# EAGLE design snullv5 (EAGLE 7.2.0)
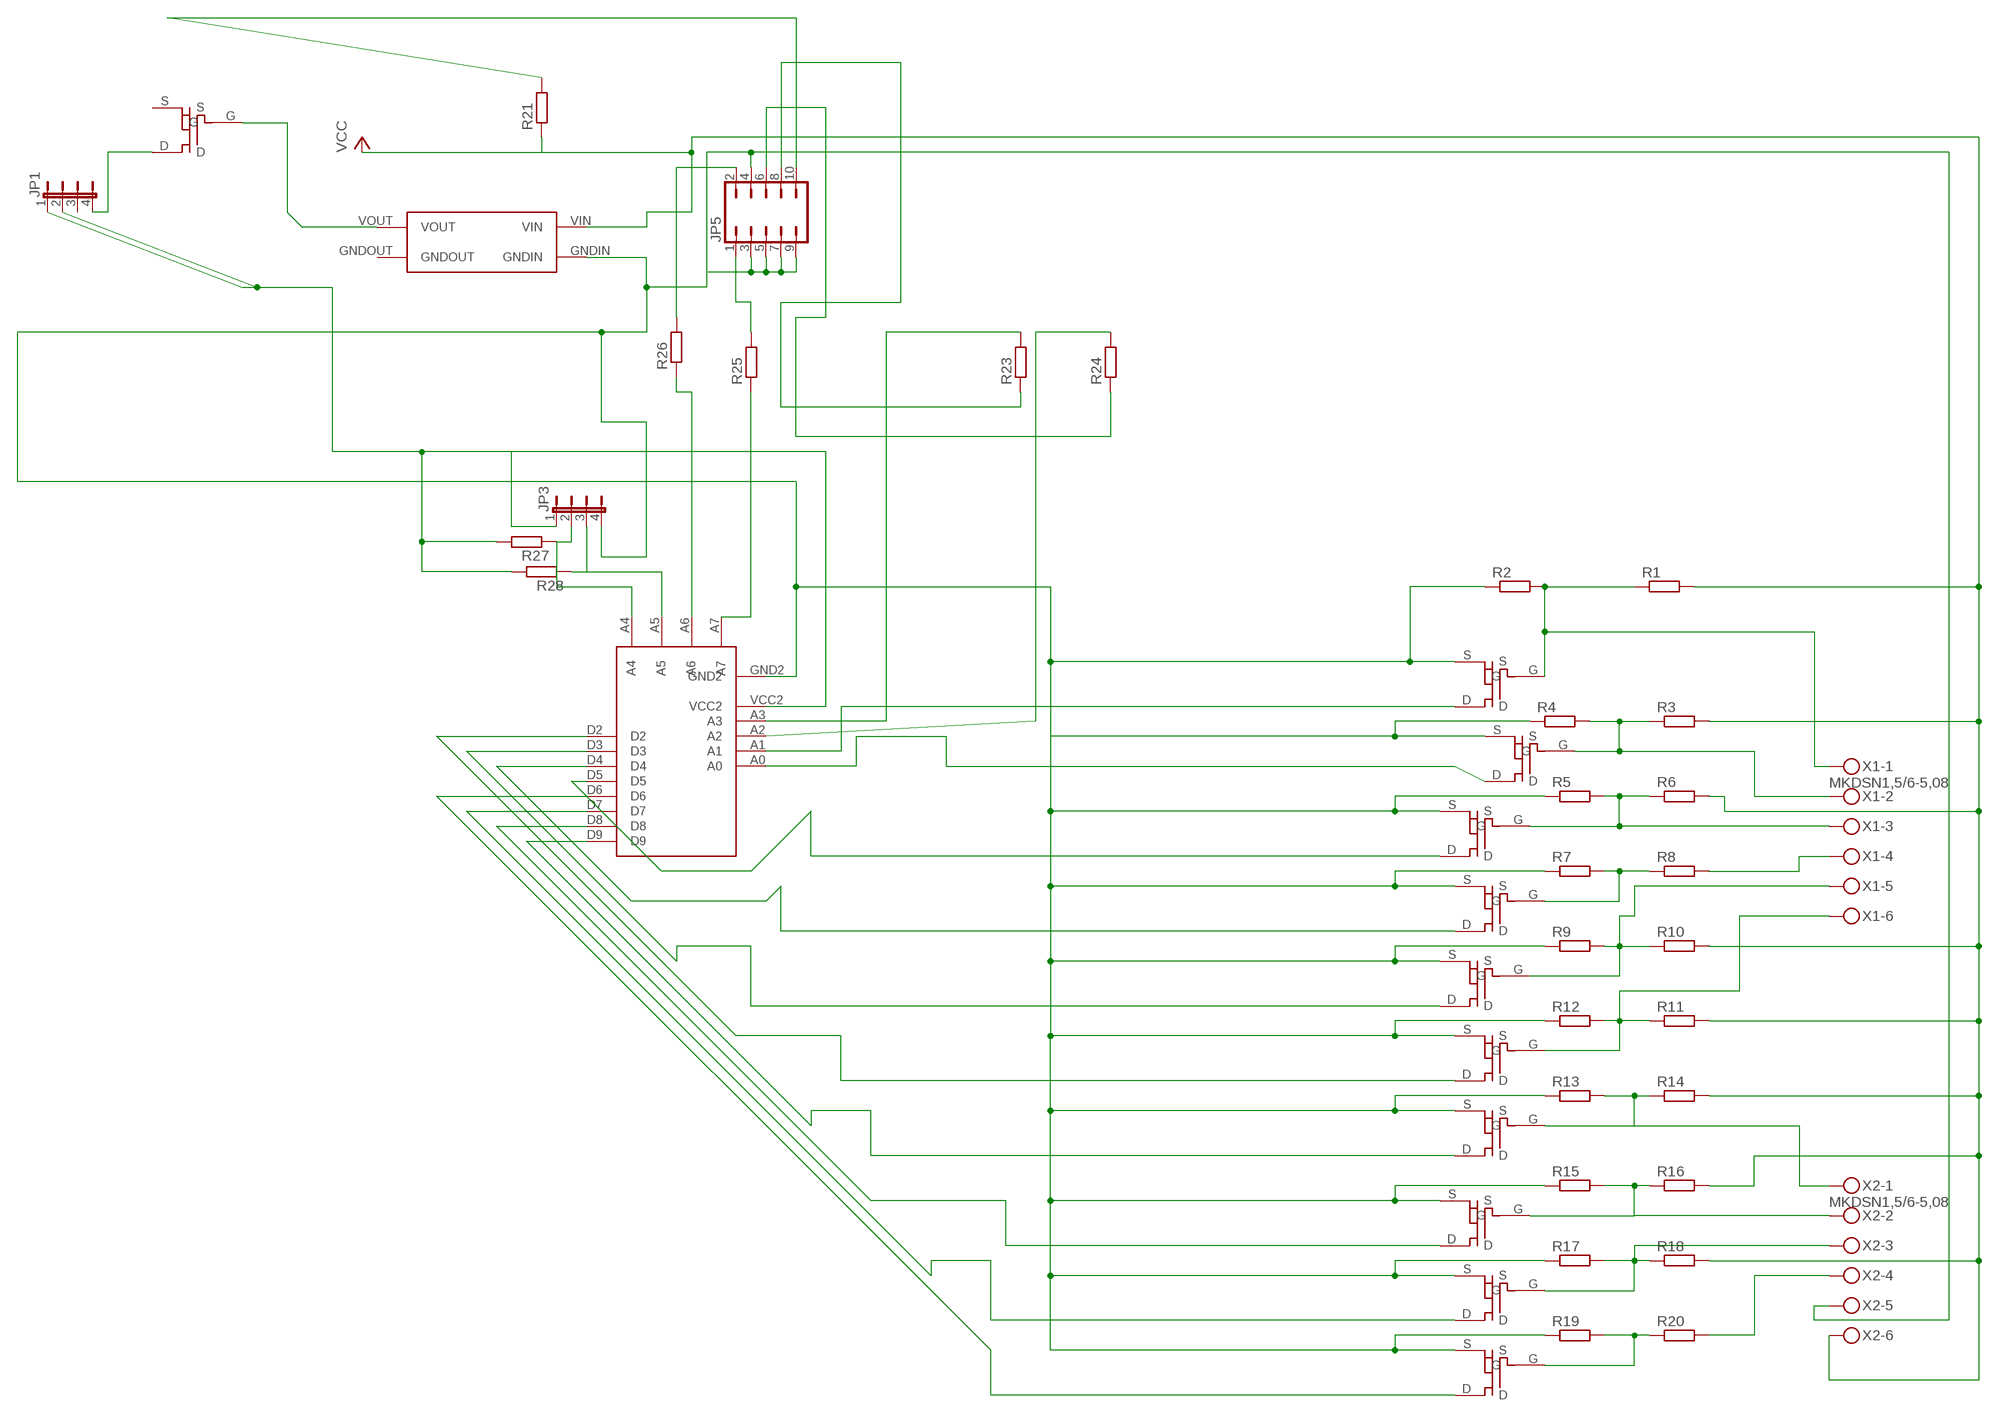
[diagram p0: schematic, sheet 1]

## Parts
JP1  JP4E  [JP4]
JP3  JP4E  [JP4]
JP5  JP5Q  [JP5Q]
R1  R-EU_R0805  [R0805]
R2  R-EU_R0805  [R0805]
R3  R-EU_R0805  [R0805]
R4  R-EU_R0805  [R0805]
R5  R-EU_R0805  [R0805]
R6  R-EU_R0805  [R0805]
R7  R-EU_R0805  [R0805]
R8  R-EU_R0805  [R0805]
R9  R-EU_R0805  [R0805]
R10  R-EU_R0805  [R0805]
R11  R-EU_R0805  [R0805]
R12  R-EU_R0805  [R0805]
R13  R-EU_R0805  [R0805]
R14  R-EU_R0805  [R0805]
R15  R-EU_R0805  [R0805]
R16  R-EU_R0805  [R0805]
R17  R-EU_R0805  [R0805]
R18  R-EU_R0805  [R0805]
R19  R-EU_R0805  [R0805]
R20  R-EU_R0805  [R0805]
R21  R-EU_R0805  [R0805]
R23  R-EU_R0805  [R0805]
R24  R-EU_R0805  [R0805]
R25  R-EU_R0805  [R0805]
R26  R-EU_R0805  [R0805]
R27  R-EU_R0805  [R0805]
R28  R-EU_R0805  [R0805]
U$1  ARDUINOPROMINIREDUCED  [ARDUINOPROMINIREDUCED]
U$2  VREGMODULE  [VREGMODULE]
U$3  MOSFET-TO236  [MOSFET-TO236]
U$4  MOSFET-TO236  [MOSFET-TO236]
U$5  MOSFET-TO236  [MOSFET-TO236]
U$6  MOSFET-TO236  [MOSFET-TO236]
U$7  MOSFET-TO236  [MOSFET-TO236]
U$8  MOSFET-TO236  [MOSFET-TO236]
U$9  MOSFET-TO236  [MOSFET-TO236]
U$10  MOSFET-TO236  [MOSFET-TO236]
U$11  MOSFET-TO236  [MOSFET-TO236]
U$12  MOSFET-TO236  [MOSFET-TO236]
U$13  MOSFET-TO236  [MOSFET-TO236]
X1  MKDSN1,5/6-5,08  [MKDSN1,5/6-5,08]
X2  MKDSN1,5/6-5,08  [MKDSN1,5/6-5,08]

## Nets
N$1: R13.2 R14.1 U$9.G X2.1
N$2: R9.2 R10.1 U$7.G X1.5
N$4: R15.2 R16.1 U$10.G X2.2
N$5: R17.2 R18.1 U$11.G X2.3
N$7: R8.2 X1.4
N$8: U$1.A0 U$4.D
N$10: U$1.A1 U$3.D
N$12: JP1.1 JP1.2 JP3.1 R27.2 R28.2 U$1.VCC2
N$13: U$1.D9 U$9.D
N$14: U$1.D4 U$6.D
N$15: U$1.D3 U$7.D
N$16: U$1.D8 U$10.D
N$17: U$1.D2 U$8.D
N$18: U$1.D5 U$5.D
N$19: U$2.VOUT U$13.G
N$21: U$1.D6 U$12.D
N$22: R1.1 R2.2 U$3.G X1.1
N$23: R3.1 R4.2 U$4.G X1.2
N$24: U$1.D7 U$11.D
N$25: R5.2 R6.1 U$5.G X1.3
N$27: R7.2 R8.1 U$6.G
N$28: R11.1 R12.2 U$8.G X1.6
N$30: R20.2 X2.4
N$31: R19.2 R20.1 U$12.G
N$34: JP5.10 R21.2
N$35: JP1.4 U$13.D
N$36: JP5.8 R23.1
N$37: JP5.6 R24.1
N$38: R23.2 U$1.A3
N$39: R24.2 U$1.A2
N$40: JP3.2 R27.1 U$1.A4
N$41: JP3.3 R28.1 U$1.A5
N$42: R26.1 U$1.A6
N$43: JP5.2 R26.2
N$44: R25.1 U$1.A7
N$45: JP5.1 R25.2
VCC: R1.2 R3.2 R6.2 R10.2 R11.2 R14.2 R16.2 R18.2 R21.1 U$2.VIN X2.6
VDD: JP3.4 JP5.3 JP5.4 JP5.5 JP5.7 JP5.9 R2.1 R4.1 R5.1 R7.1 R9.1 R12.1 R13.1 R15.1 R17.1 R19.1 U$1.GND2 U$2.GNDIN U$3.S U$4.S U$5.S U$6.S U$7.S U$8.S U$9.S U$10.S U$11.S U$12.S X2.5
Unconnected: JP1.3 U$2.GNDOUT U$13.S

## Library data of the parts
JP1 JP3 = jumper:JP4E: JUMPER
JP5 = jumper:JP5Q: JUMPER
R1-R21 R23-R28 = resistor:R-EU_: RESISTOR, European symbol
U$1 = snulllib:ARDUINOPROMINIREDUCED
U$2 = snulllib:VREGMODULE
U$3-U$13 = snulllib:MOSFET-TO236
X1 X2 = con-phoenix-508:MKDSN1,5/6-5,08: MKDSN 1,5/ 6-5,08 Printklemme Nennstrom: 13,5 A Nennspannung: 250 V Rastermaß: 5,08 mm Polzahl: 6 Anschlussart: Schraubanschluss Montage: Löten Anschlussrichtung Leiter/Platine: 0 ° Artikelnummer: 1729160 Source: http://eshop.phoenixcontact.com .. 1729160.pdf

## Board
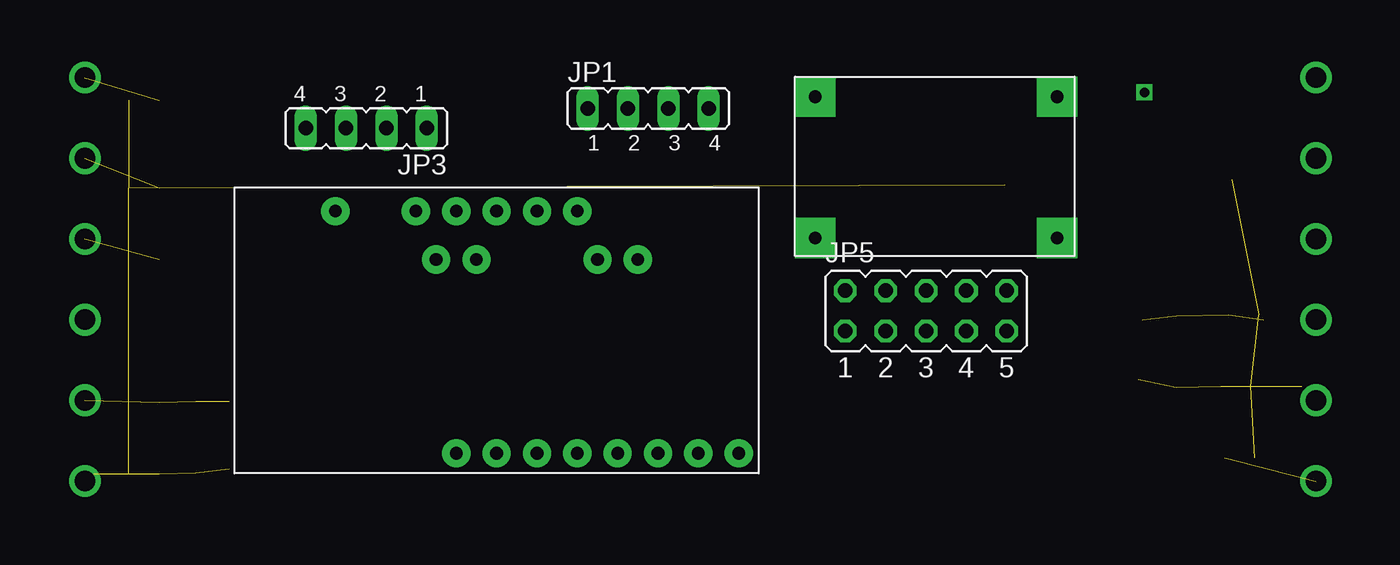
[diagram p1: board, top side]
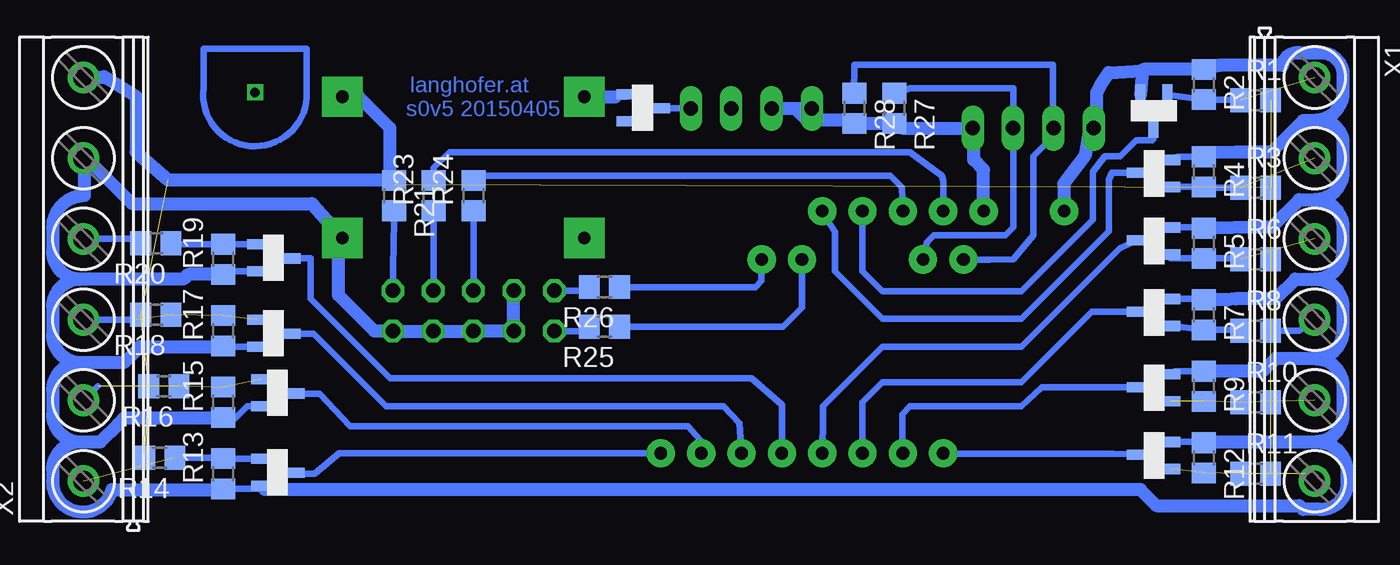
[diagram p2: board, bottom side, seen from below]

No outline drawn. Coordinates in mm, seen from the top.
Copper layers (1*16): Top 0.035mm / dielectric 1.5mm / Bottom 0.035mm
Design rules "default": minimum track width 10mil, minimum drill 24mil, track to track 8mil, track to pad 8mil, pad to pad 8mil, via to via 8mil, smd to smd 8mil, copper to edge 40mil, drill to drill 8mil, minimum pad ring 10mil, minimum via ring 8mil, stop-mask expansion 4mil, vias tented up to drill 0mil, thermal gap 10mil

### Footprints (pad centres in the part's own frame; a part is rotated, then mirrored left to right if it is on the bottom)
JP4 = drill 0.914 long: 1 -3.81,0; 2 -1.27,0; 3 1.27,0; 4 3.81,0
JP5Q = drill 0.914 octagon: 1 -5.08,-1.27; 2 -5.08,1.27; 3 -2.54,-1.27; 4 -2.54,1.27; 5 0,-1.27; 6 0,1.27; 7 2.54,-1.27; 8 2.54,1.27; 9 5.08,-1.27; 10 5.08,1.27
R0805 = smd 1.3 x 1.5: 1 -0.95,0; 2 0.95,0
ARDUINOPROMINIREDUCED = drill 0.8 pad 1.778: A0 16.51,-21.59; A1 16.51,-19.05; A2 16.51,-16.51; A3 16.51,-13.97; A4 13.462,-15.24; A5 13.462,-12.7; A6 13.462,-25.4; A7 13.462,-22.86; D2 1.27,-13.97; D3 1.27,-16.51; D4 1.27,-19.05; D5 1.27,-21.59; D6 1.27,-24.13; D7 1.27,-26.67; D8 1.27,-29.21; D9 1.27,-31.75; GND2 16.51,-6.35; VCC2 16.51,-11.43
VREGMODULE = drill 0.8 pad 2.54 square: GNDIN 16.51,-10.16; GNDOUT 1.27,-10.16; VIN 16.51,-1.27; VOUT 1.27,-1.27
MOSFET-TO236 = smd 0.635 x 1.27: D 1.5,1.73; G 0.6,-0.37; S 2.3,-0.37
MKDSN1,5/6-5,08 = drill 1.3 pad 2: 1 -12.7,0.025; 2 -7.62,0.025; 3 -2.54,0.025; 4 2.54,0.025; 5 7.62,0.025; 6 12.7,0.025

### Placement (x,y rotation side)
JP1  39.25,26 0 top
JP3  21.5,24.75 180 top
JP5  56.75,13.25 0 top
R1  7.5,26.5 0 bottom
R2  10.75,27.5 270 bottom
R3  7.5,21 0 bottom
R4  10.75,22 270 bottom
R5  10.75,17.5 270 bottom
R6  7.5,16.5 0 bottom
R7  10.75,13 270 bottom
R8  7.5,12 0 bottom
R9  10.75,8.5 270 bottom
R10  7.5,7.5 0 bottom
R11  7.5,3 0 bottom
R12  10.75,4 270 bottom
R13  72.5,3 90 bottom
R14  76.5,4 180 bottom
R15  72.5,7.5 90 bottom
R16  76.25,8.5 180 bottom
R17  72.5,12 90 bottom
R18  76.75,13 180 bottom
R19  72.5,16.5 90 bottom
R20  76.75,17.5 180 bottom
R21  61.75,20.5 270 bottom
R23  59.25,20.5 90 bottom
R24  56.75,20.5 90 bottom
R25  48.5,12.25 180 bottom
R26  48.5,14.75 180 bottom
R27  30.25,26 270 bottom
R28  32.75,26 270 bottom
U$1  13.2,3.02 90 top
U$2  48.5,28 0 top
U$3  12.45,26.5 180 bottom
U$4  13.25,20.45 90 bottom
U$5  13.25,16.2 90 bottom
U$6  13.25,11.7 90 bottom
U$7  13.25,6.95 90 bottom
U$8  13.25,2.7 90 bottom
U$9  69.75,4.55 270 bottom
U$10  69.75,9.55 270 bottom
U$11  70,13.3 270 bottom
U$12  70,18.05 270 bottom
U$13  46.75,27.5 270 bottom
X1  3.81,15.24 270 bottom
X2  81.28,15.24 90 bottom

### Tracks (layer width: path | path; a pad name or v marks a point on that pad's centre or on a via)
N$1  (1 unrouted)
  Bottom 0.406: R14.1 72.55,4 R13.2 U$9.G
N$2  (3 unrouted)
N$4  (3 unrouted)
  Bottom 0.406: 80.42,8.5 X2.2
N$5  (3 unrouted)
  Bottom 0.406: X2.3 78,12.7
N$7
  Bottom 0.406: R8.2 4.74,12 X1.4
N$8
  Bottom 0.406: U$4.D 16.55,21.95 16.75,21.5 16.75,18.25 22.25,12.75 31,12.75 34,15.75 34,18.24 U$1.A0
N$10
  Bottom 0.406: U$1.A1 32.25,15.75 31,14.5 22.25,14.5 17.75,19 17.75,22 17,23 16,23 15,24 14,24 13.95,24.05 U$3.D
N$12
  Bottom 0.406: 25.25,25 25.25,24.94 | 25.25,24.94 JP3.1 | R27.2 30.2,25.2 29.75,24.75 | 25.25,24.75 25.25,24.94 | R28.2 32.95,25.25
  Bottom 0.813: JP1.2 JP1.1 36.25,25.75 35.75,25.25 32.95,25.25 | R28.2 R27.2 | U$1.VCC2 24.63,22.13 25.25,22.75 25.25,24.75 29.75,24.75
N$13
  Bottom 0.406: U$1.D9 65.21,4.29 66.75,3 67.97,3 U$9.D
N$14
  Bottom 0.406: U$1.D4 32.25,7.5 31,8.75 22.25,8.75 17.8,13.2 U$6.D
N$15
  Bottom 0.406: U$7.D 20.95,8.45 22.25,7.25 29.25,7.25 29.75,6.75 29.75,5.08 U$1.D3
N$16
  Bottom 0.406: U$10.D 66.45,8.05 64.5,6 43.25,6 42.5,5.13 U$1.D8
N$17
  Bottom 0.406: U$8.D 14.7,4.2 16.5,4.25 26.21,4.25 U$1.D2
N$18
  Bottom 0.406: U$5.D 16.05,17.2 22.25,11 31,11 34.75,7.25 34.75,5.83 U$1.D5
N$19
  Bottom 0.406: 47.81,26.73 47.12,26.73 U$13.G
  Bottom 0.813: U$2.VOUT 47.81,26.73
N$21
  Bottom 0.406: U$12.D 67,16.55 67,14 62,9 39.25,9 37.33,7.33 U$1.D6
N$22  (1 unrouted)
  Bottom 0.406: U$3.G R2.2 9,26.55 R1.1
N$23  (1 unrouted)
  Bottom 0.406: U$4.G R4.2 10.7,21 R3.1
N$24
  Bottom 0.406: U$11.D 66.8,11.8 62.25,7.25 41,7.25 40,6.17 U$1.D7
N$25  (1 unrouted)
  Bottom 0.406: R6.1 8.5,16.55 R5.2 12.88,16.55 U$5.G
N$26
  Bottom 0.406: 67.25,29.75 67.25,27 arc189 73.75,27.25 73.75,29.75 67.25,29.75
N$27
  Bottom 0.406: R8.1 8.5,12.05 R7.2 U$6.G
N$28  (3 unrouted)
  Bottom 0.406: 4.33,3 X1.6
N$30
  Bottom 0.406: X2.4 77.98,17.78 R20.2
N$31
  Bottom 0.406: R20.1 75.75,17.45 R19.2 U$12.G
N$34
  Bottom 0.406: R21.2 61.75,18.94 JP5.10
N$35
  Bottom 0.406: JP1.4 U$13.D
N$36
  Bottom 0.406: R23.1 59.25,15.98 JP5.8
N$37
  Bottom 0.406: R24.1 JP5.6
N$38
  Bottom 0.406: U$1.A3 27.17,21.42 27.25,21.75 29.25,23.25 58.25,23.25 59.25,22.25 R23.2
N$39
  Bottom 0.406: U$1.A2 29.78,21.03 30.5,21.75 56.25,21.75 R24.2
N$40
  Bottom 0.406: U$1.A4 28.19,17.56 27.75,18 23.25,18 22.75,18.5 22.75,25.73 JP3.2 22.75,25.77 22.75,27.25 29.25,27.25 30.05,26.95 R27.1
N$41
  Bottom 0.406: U$1.A5 24.27,16.48 22.75,16.5 21.5,18 21.5,23 20.5,24 20.25,25.25 20.25,25.73 JP3.3 20.25,25.77 20.25,28.75 32.75,28.75 32.8,26.95 R28.1
N$42
  Bottom 0.406: U$1.A6 38.6,15.15 39,14.75 R26.1
N$43
  Bottom 0.406: JP5.2 49.43,14.52 R26.2
N$44
  Bottom 0.406: U$1.A7 36.06,13.44 37.25,12.25 R25.1
N$45
  Bottom 0.406: JP5.1 49.72,11.98 R25.2
N$46  (via drill 0.6)
  other vias: 70.5,27
VCC  (8 unrouted)
  Bottom 0.406: X2.6 81.14,27.77 | R21.1 62,21.7 | 80.02,28.02 79.94,27.94 | 61.75,21.5 61.7,21.2
  Bottom 0.813: 80.02,28.02 78,26.75 78,23.25 76,21.5 61.75,21.5 | 65.25,26.49 U$2.VIN 63.98,26.73 62,24.75 62,21.7 | 79.94,27.94 X2.6 | 61.7,21.2 R21.1
VDD
  Bottom 0.406: 80.75,22.5 81.25,22.91 X2.5 arc90 81.25,22.8 | 14.58,28.45 U$3.S | U$4.S 12.43,22.95 R4.1 10.55,23.2 | U$5.S 10.8,18.5 R5.1 10.55,18.45 | U$6.S 10.95,14 R7.1 | R9.1 12.58,9.45 U$7.S | U$8.S 10.7,5 R12.1 10.45,5 | 72.55,11 R17.1 72.45,11 U$11.S | U$10.S 71,7.25 71.75,6.5 72.45,6.5 R15.1 | U$12.S 72.3,15.75 R19.1 | 72.45,2 R13.1 | 69.87,2 U$9.S 70.32,2.05 R13.1 | 78.75,6.5 78.88,6.38 | 72.55,2 R13.1 | JP3.4 17.75,25.06 17.5,25.31 | 65.25,17.6 U$2.GNDIN
  Bottom 0.813: 78.88,6.38 79.13,6.12 80.25,5 81.5,5 | 14.58,28.45 R2.1 9.75,28.7 5.8,28.7 arc90 4.75,29.5 3.25,29.5 arc90 2,28 2,27 arc90 3.75,25.25 | 72.55,11 77.75,11 78.75,10 81.5,10 | 69.87,2 14.75,2 13.75,1 4.75,1 4.5,0.75 3.5,0.75 arc-90 1.75,2.25 1.75,3.25 arc-90 3.75,5 | 10.45,5 3.75,5 | 72.45,6.5 78.75,6.5 | 80.75,22.5 78.25,20 66.92,20 66.84,19.92 U$2.GNDIN | 81.25,22.8 81.25,20.5 arc-90 83.25,18.5 83.25,17 arc-90 81.5,15.25 | 81.5,15.25 arc-90 83.25,13.5 83.25,11.75 arc-90 81.5,10 | 81.5,10 arc-90 83.25,8.25 83.25,6.75 arc-90 81.5,5 | 81.5,5 arc-90 83.25,3.25 83.25,2.5 arc-165 79.5,2 72.55,2 | R19.1 74.7,15.55 75,15.25 81.5,15.25 | 3.75,25.25 arc90 2,24 2,22 arc90 3.75,20.25 | 3.75,20.25 arc90 2,18.5 2,17 arc90 3.75,15.25 | 3.75,15.25 arc90 2,13.5 2,12 arc90 3.75,10.25 | 3.75,10.25 arc90 2,8.5 2,6.75 arc90 3.75,5 | 3.75,15.25 5,15.25 6.25,14 8.75,14 9.3,13.95 R7.1 | 3.75,20.25 4.75,20.25 6.5,18.5 7.25,18.5 10.55,18.45 | 3.75,25.25 4.5,25.25 6.5,23.25 8.75,23.25 10.55,23.2 | 3.75,10.25 6.25,10.25 7,9.5 7.3,9.45 R9.1 | JP3.4 17.94,24.81 18.25,23 19.58,21.25 U$1.GND2 | 65.25,17.6 65.25,14.25 62.98,11.98 JP5.9 JP5.7 JP5.5 JP5.3 JP5.4 | 17.5,25.31 17.5,27 17.25,27.5 16.75,28.25 14.63,28.38 U$3.S

### Text on the board
Bottom: langhofer.at | s0v5 20150405